# EAGLE design XOR Gate (EAGLE 6.5.0)
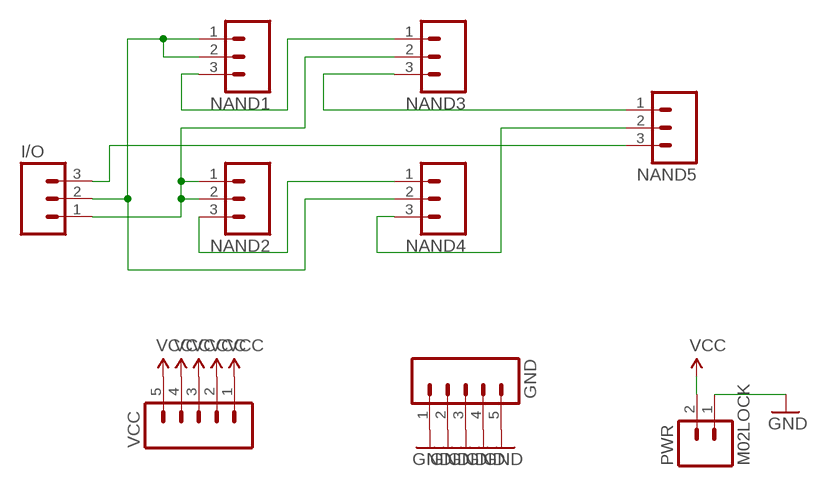
[diagram p0: schematic, sheet 1]

## Parts
GND  M05LOCK  [1X05_LOCK]
I/O  M03LOCK  [1X03_LOCK]
NAND1  M03LOCK  [1X03_LOCK]
NAND2  M03LOCK  [1X03_LOCK]
NAND3  M03LOCK  [1X03_LOCK]
NAND4  M03LOCK  [1X03_LOCK]
NAND5  M03LOCK  [1X03_LOCK]
PWR  M02LOCK  [1X02_LOCK]
VCC  M05LOCK  [1X05_LOCK]

## Nets
GND: GND.1 GND.2 GND.3 GND.4 GND.5 PWR.1
N$1: I/O.3 NAND5.3
N$2: I/O.2 NAND1.1 NAND1.2 NAND4.2
N$3: NAND1.3 NAND3.1
N$4: I/O.1 NAND2.1 NAND2.2 NAND3.2
N$5: NAND2.3 NAND4.1
N$6: NAND3.3 NAND5.1
N$7: NAND4.3 NAND5.2
VCC: PWR.2 VCC.1 VCC.2 VCC.3 VCC.4 VCC.5

## Library data of the parts
GND VCC = SparkFun-Connectors:M05: Header 5 Standard 5-pin 0.1" header. Use with straight break away headers (SKU : PRT-00116), right angle break away headers (PRT-00553), swiss pins (PRT-00743), machine pins (PRT-00117), and female headers (PRT-00115). Molex polarized connector foot print use with SKU : PRT-08230 with associated crimp pins and housings.
I/O NAND1-NAND5 = SparkFun-Connectors:M03: Header 3 Standard 3-pin 0.1" header. Use with straight break away headers (SKU : PRT-00116), right angle break away headers (PRT-00553), swiss pins (PRT-00743), machine pins (PRT-00117), and female headers (PRT-00115). Molex polarized connector foot print use with SKU : PRT-08232 with associated crimp pins and housings.
PWR = SparkFun-Connectors:M02: Standard 2-pin 0.1" header. Use with - straight break away headers ( PRT-00116) - right angle break away headers (PRT-00553) - swiss pins (PRT-00743) - machine pins (PRT-00117) - female headers (PRT-00115) Molex polarized connector foot print use with: PRT-08233 with associated crimp pins and housings. 2.54_SCREWTERM for use with PRT-10571. 3.5mm Screw Terminal footprints for PRT-08084 5mm Screw Terminal footprints for use with PRT-08433

## Board
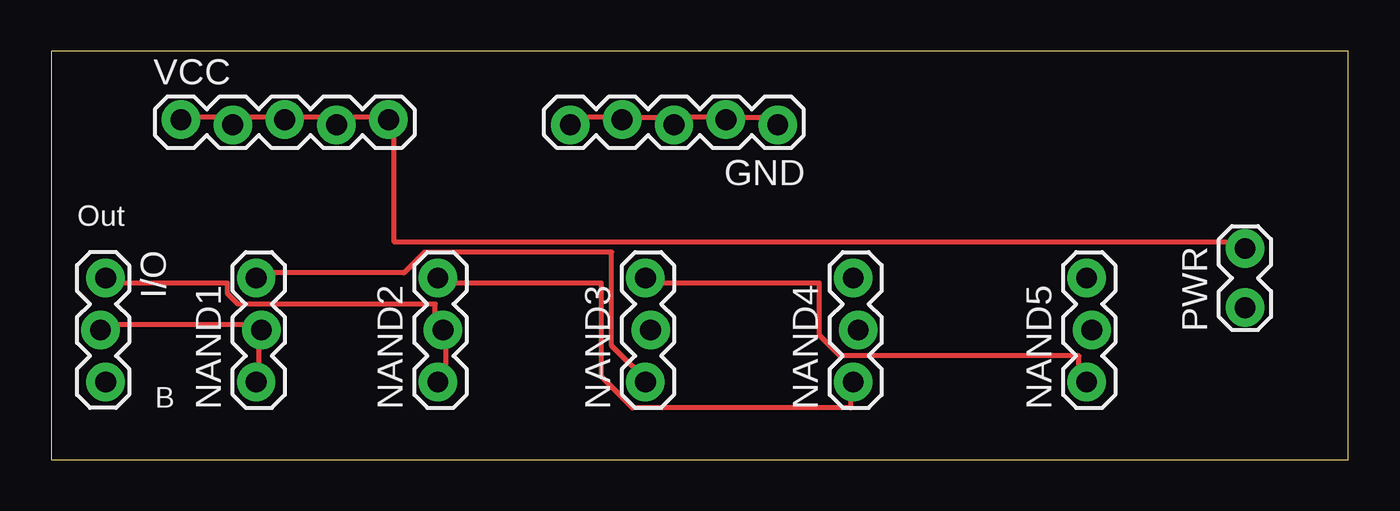
[diagram p1: board, top side]
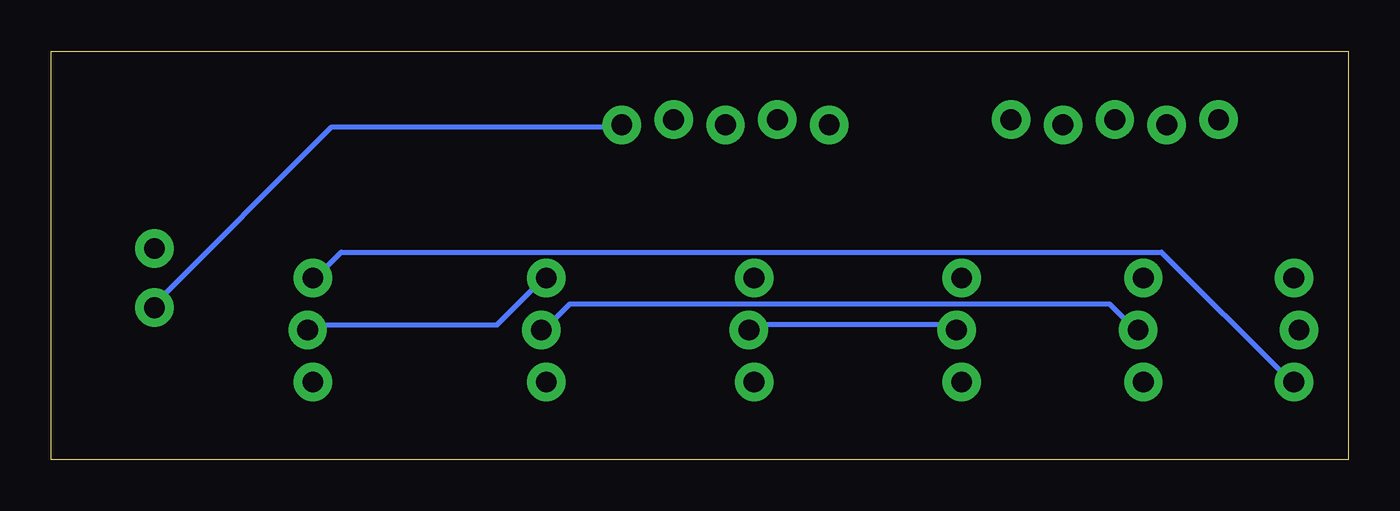
[diagram p2: board, bottom side, seen from below]

Size 63.48 x 19.99 mm. Coordinates in mm from the lower left corner, seen from the top.
Outline: 0,0 63.48,0 63.48,19.99 0,19.99 0,0
Copper layers (1*16): Top 0.035mm / dielectric 1.5mm / Bottom 0.035mm
Design rules "default": minimum track width 10mil, minimum drill 24mil, track to track 8mil, track to pad 8mil, pad to pad 8mil, via to via 8mil, smd to smd 8mil, copper to edge 40mil, drill to drill 8mil, minimum pad ring 10mil, minimum via ring 8mil, stop-mask expansion 4mil, vias tented up to drill 0mil, thermal gap 10mil

### Footprints (pad centres in the part's own frame; a part is rotated, then mirrored left to right if it is on the bottom)
1X05_LOCK = drill 1.016 pad 1.88: 1 0,0.127; 2 2.54,-0.127; 3 5.08,0.127; 4 7.62,-0.127; 5 10.16,0.127
1X03_LOCK = drill 1.016 pad 1.88: 1 0,0.127; 2 2.54,-0.127; 3 5.08,0.127
1X02_LOCK = drill 1.016 pad 1.88: 1 -0.178,0; 2 2.718,0

### Placement (x,y rotation side)
GND  35.56,16.51 180 top
I/O  2.54,8.89 270 top
NAND1  10.16,3.81 90 top
NAND2  19.05,3.81 90 top
NAND3  29.21,3.81 90 top
NAND4  39.37,3.81 90 top
NAND5  50.8,3.81 90 top
PWR  58.42,7.62 90 top
VCC  6.35,16.51 0 top

### Tracks (layer width: path | path; a pad name or v marks a point on that pad's centre or on a via)
GND
  Top 0.254: 27.94,16.76 25.4,16.76 GND.5 | 27.94,16.76 30.48,16.76 | 27.94,16.76 GND.4 | 33.02,16.76 35.56,16.76 GND.1 | 33.02,16.76 30.48,16.76 | 30.48,16.76 GND.3 | 33.02,16.76 GND.2
  Bottom 0.254: PWR.1 58.42,7.62 49.78,16.26 35.56,16.26 GND.1
N$1
  Bottom 0.254: I/O.3 3.05,4.06 9.14,10.16 49.28,10.16 50.29,9.14 NAND5.3
N$2
  Top 0.254: NAND1.1 10.16,4.06 10.16,6.1 NAND1.2 10.16,6.6 2.54,6.6 I/O.2
  Bottom 0.254: NAND4.2 39.12,6.6 38.1,7.62 11.68,7.62 10.67,6.6 NAND1.2
N$3
  Top 0.254: NAND1.3 10.16,9.14 17.27,9.14 18.29,10.16 27.43,10.16 27.43,5.59 28.96,4.06 NAND3.1
N$4
  Top 0.254: NAND2.1 19.3,4.06 19.3,6.1 NAND2.2 18.8,6.6 18.8,7.62 9.14,7.62 8.64,8.13 8.64,8.64 3.05,8.64 I/O.1
  Bottom 0.254: NAND3.2 28.96,6.6 19.3,6.6 NAND2.2
N$5
  Top 0.254: NAND2.3 19.3,8.64 26.92,8.64 26.92,4.06 28.45,2.54 39.12,2.54 39.12,3.56 NAND4.1
N$6
  Top 0.254: NAND3.3 29.46,8.64 37.59,8.64 37.59,6.1 38.61,5.08 50.29,5.08 50.29,4.06 NAND5.1
N$7
  Bottom 0.254: NAND4.3 39.62,8.64 41.66,6.6 50.8,6.6 NAND5.2
VCC
  Top 0.254: VCC.1 6.6,16.76 8.64,16.76 VCC.2 9.14,16.76 11.18,16.76 VCC.3 11.68,16.76 13.72,16.76 VCC.4 14.22,16.76 16.26,16.76 VCC.5 16.76,16.26 16.76,10.67 58.42,10.67 PWR.2

### Text on the board
tPlace: Out | B